# Altium schematic sheet Conector_USB_Maestro.SchDoc
size A4; SheetNumber: 6; SheetTotal: 22
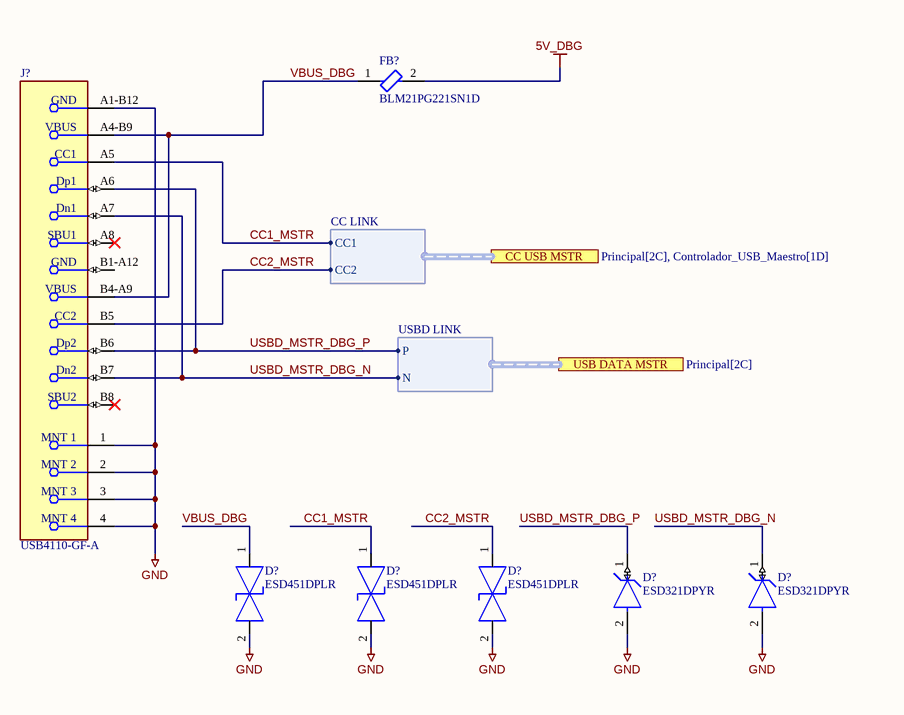
[diagram p0: Conector_USB_Maestro.SchDoc]

## Parts
(Parts that share a designator on the sheet are numbered #1, #2 ... from top to bottom, then left to right.)
D?#1  ESD451DPLR  [FP-DPL0002A_MFG]
D?#2  ESD451DPLR  [FP-DPL0002A_MFG]
D?#3  ESD451DPLR  [FP-DPL0002A_MFG]
D?#4  ESD321DPYR  [FP-DPY0002A-MFG]
D?#5  ESD321DPYR  [FP-DPY0002A-MFG]
FB?  BLM21PG221SN1D  [FP-BLM21-0_2-t0_85-e0_5-IPC_B]
J?  USB4110-GF-A  [FP-USB4110-GF-A-MFG]

## Ports
CC USB MSTR (harness CC LINK, see Principal[2C], Controlador_USB_Maestro[1D]), USB DATA MSTR (harness USBD LINK, see Principal[2C])

## Harnesses
USBD LINK: P, N
CC LINK: CC1, CC2

## Nets
5V_DBG: FB?.2
GND: D?#1.2(2_IO) D?#2.2(2_IO) D?#3.2(2_IO) D?#4.2(GND) D?#5.2(GND) J?.1(MNT_1) J?.2(MNT_2) J?.3(MNT_3) J?.4(MNT_4) J?.A1-B12(GND)
CC1_MSTR: D?#2.1(1_IO) J?.A5(CC1) ; port CC USB MSTR.CC1
CC2_MSTR: D?#3.1(1_IO) J?.B5(CC2) ; port CC USB MSTR.CC2
USBD_MSTR_DBG_N: D?#5.1(IO) J?.A7(Dn1) J?.B7(Dn2) ; port USB DATA MSTR.N
USBD_MSTR_DBG_P: D?#4.1(IO) J?.A6(Dp1) J?.B6(Dp2) ; port USB DATA MSTR.P
VBUS_DBG: D?#1.1(1_IO) FB?.1 J?.A4-B9(VBUS) J?.B4-A9(VBUS)

Not connected (* = marked no-connect by the designer): J? A8(SBU1)* B1-A12(GND) B8(SBU2)*

## Library data of the parts
D?#1-D?#3 = CMP-00370-140306676-1: 0.5-pF, 5.5-V, 30-KV bidirectional ESD protection device in 0201 package 2-X2SON -40 to 125; Manufacturer Lifecycle Status: ACTIVE; Thickness: 300µm; ComponentLink3URL: https://www.ti.com/lit/ds/symlink/tpd1e04u04.pdf?ts=1701165483995&ref_url=https%253A%252F%252Fwww.ti.com%252Fproduct%252FTPD1E04U04%252Fpart-details%252FTPD1E04U04DPLR; ComponentLink3Description: Manufacturer's Package Drawing; Lifecycle Status: Production; ComponentLink1URL: http://ti.com; ComponentLink2Description: HelpURL; Width: 300µm; ComponentLink2URL: https://www.ti.com/lit/ds/symlink/esd451.pdf; Height: 320µm; Number of Pins: 2; ComponentLink1Description: Manufacturer's Website; Length: 600µm
D?#4 D?#5 = CMP-04989-000001-1: HDMI2.0 ESD PROTECTION; Manufacturer: Texas Instruments; Standoff Height: 0mm; Peak Pulse Current: 6A; Value: 0.9pF; Number Of Channels: 1; Reverse Standoff Voltage: 3.6V; Peak Pulse Power: 40W; Breakdown Voltage: 4.5V; Direction: Unidirectional; Clamping Voltage: 6.8V; RoHS: TRUE; Temperature: -40°C to +125°C; Package: DPY0002A; Temperature Range Low: -40°C; Temperature Range High: +125°C; Category: Diode; Capacitance: 0.9pF; Ambient Temperature Range Low: -40°C; Device Class L3: unset; Device Class L1: Circuit Protection; Ambient Temperature Range High: +125°C; ComponentLink2URL: http://www.ti.com/lit/ds/symlink/esd321.pdf; Octopart: https://octopart.com/esd321dpyr-texas+instruments-94354200; Manufacturer Part Number: ESD321DPYR; Digikey Description: HDMI2.0 ESD PROTECTION; Lead Free: Yes; ComponentLink2Description: Datasheet; Device Class L2: TVS Diodes; Height: 0.45mm; Automotive: No
FB? = CMP-0686-00610-3: Chip Ferrite Bead, 0805, 220Ω @ 100MHz, 0.045Ω, 25%, 2A; Number of Circuits: 1; Shielding: Unshielded; DC Resistance (DCR): 45mR; Impedance: 220R; Radiation Hardening: No; Material: Ferrite; Frequency: 100MHz; Width: 1.25mm; DC Current: 2A; Max DC Current: 2A; Number of Lines: 1; Package Quantity: 1; Case Code (Metric): 2012; Current Rating: 2A; Case/Package: 0805; Current: 2A; Military Standard: Not; Core Material: Ferrite; Depth: 1.25mm; Contact Plating: Tin; DC Resistance-Max: 45mR; Max Operating Temperature: 125°C; Length: 2mm; Max Current Rating: 2A; REACH SVHC: No SVHC; Termination: SMD/SMT; Min Operating Temperature: -55°C; Series: BLM21P; Test Frequency: 100MHz; Tolerance: 25%; Number of Pins: 2; RoHS Compliant: Yes; Height: 0.85mm; Packaging: Tape and Reel; Lead Free: Lead Free; Case Code (Imperial): 0805
J? = CMP-245163-000002-1: CONN USB 2.0 TYPE-C R/A SMT; Manufacturer: GCT; Conn Orientation: Right Angle; Usb Standard: USB 2.0; Voltage Rating: 20V; Current Rating: 3/4.25/1.25/0.25A; Number Of Contacts: 16; Is Female: yes; Shielding: true; Standoff Height: 0.1mm; Octopart: https://octopart.com/usb4110-gf-a-gct-103941985; Temperature: -40°C to +85°C; RoHS: TRUE; Automotive: No; Contact Material: Gold,Nickel; Device Class L1: Connectors; Device Class L2: USB Connectors; Package: 0; Lead Free: Yes; ComponentLink2URL: https://gct.co/files/drawings/usb4110.pdf; Temperature Range High: +85°C; Temperature Range Low: -40°C; Height: 3.46mm; Manufacturer Part Number: USB4110-GF-A; ComponentLink2Description: Datasheet; Device Class L3: unset; Digikey Description: CONN USB 2.0 TYPE-C R/A SMT; Category: Conn